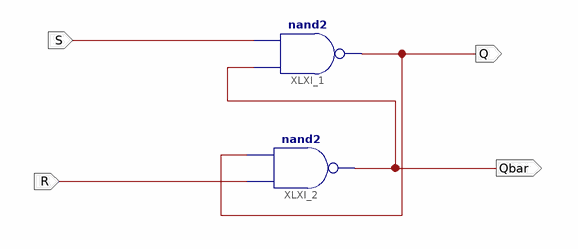
[diagram p0: schematic sheet 1]
// Xilinx ISE schematic SE_LATCH.sch (kintex7) as structural Verilog: 2 symbols, 4 ports
module SE_LATCH (
  input  R,
  input  S,
  output Qbar,
  output Q
);

  nand XLXI_1 (Q, Qbar, S);
  nand XLXI_2 (Qbar, R, Q);
endmodule
